# Altium schematic sheet Display.SchDoc
size A4; SheetNumber: 3; SheetTotal: 5
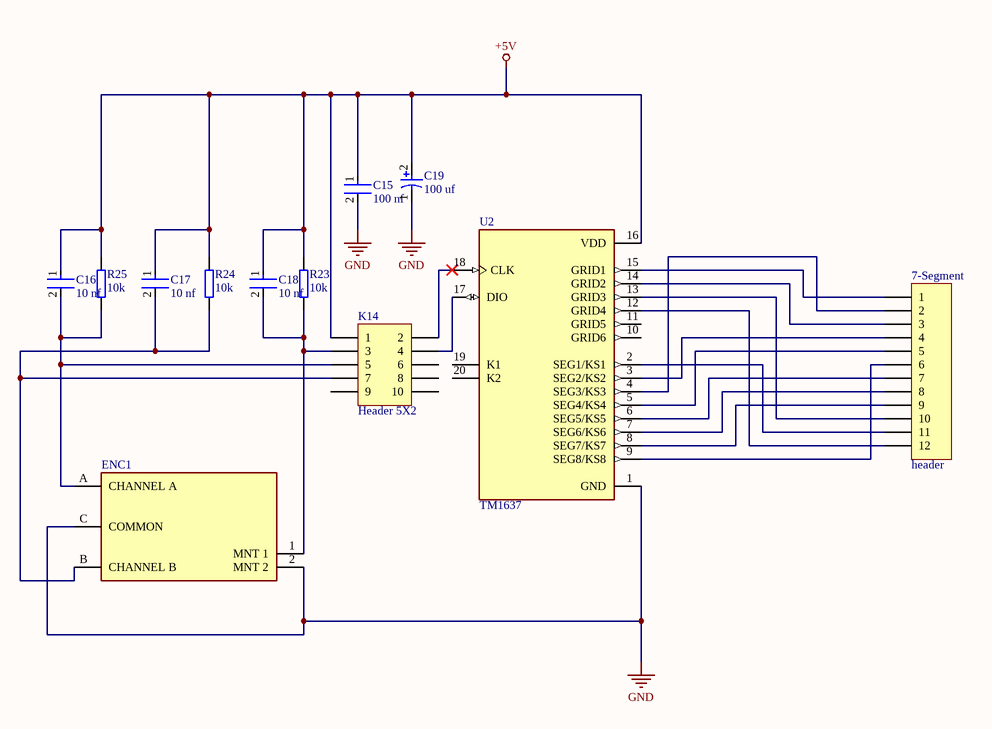
[diagram p0: Display.SchDoc]

## Parts
7-Segment  header  [HDR1X12]
C15  100 nf  [CC_0805_L]
C16  10 nf  [CC_0805_L]
C17  10 nf  [CC_0805_L]
C18  10 nf  [CC_0805_L]
C19  100 uf  [CE_D8_L10]
ENC1  (no value)  [PEC11R_4220F_S0012]
K14  Header 5X2  [HDR2X5]
R23  10k  [CC_0805_m]
R24  10k  [CC_0805_m]
R25  10k  [CC_0805_m]
U2  TM1637  [SOP_20_M]

## Nets
+5V: C15.1 C16.1 C17.1 C18.1 C19.2 K14.1 R23.2 R24.2 R25.2 U2.16(VDD)
GND: C15.2 C19.1 ENC1.2(MNT_2) ENC1.C(COMMON) U2.1(GND)
Net7-Segment_1: 7-Segment.1 U2.15(GRID1)
Net7-Segment_2: 7-Segment.2 U2.4(SEG3/KS3)
Net7-Segment_3: 7-Segment.3 U2.14(GRID2)
Net7-Segment_4: 7-Segment.4 U2.3(SEG2/KS2)
Net7-Segment_5: 7-Segment.5 U2.5(SEG4/KS4)
Net7-Segment_6: 7-Segment.6 U2.9(SEG8/KS8)
Net7-Segment_7: 7-Segment.7 U2.6(SEG5/KS5)
Net7-Segment_8: 7-Segment.8 U2.7(SEG6/KS6)
Net7-Segment_9: 7-Segment.9 U2.8(SEG7/KS7)
Net7-Segment_10: 7-Segment.10 U2.13(GRID3)
Net7-Segment_11: 7-Segment.11 U2.2(SEG1/KS1)
Net7-Segment_12: 7-Segment.12 U2.12(GRID4)
NetC16_2: C16.2 ENC1.A(CHANNEL_A) K14.5 R25.1
NetC17_2: C17.2 ENC1.B(CHANNEL_B) K14.7 R24.1
NetC18_2: C18.2 ENC1.1(MNT_1) K14.3 R23.1
NetK14_2: K14.2 U2.18(CLK)
NetK14_4: K14.4 U2.17(DIO)

Not connected (* = marked no-connect by the designer): K14 6 8 9 10; U2 10(GRID6) 11(GRID5) 19(K1) 20(K2)

## Library data of the parts
7-Segment = Header 12: Header, 12-Pin; LatestRevisionDate: 17-Jul-2002; LatestRevisionNote: Re-released for DXP Platform.; Publisher: Altium Limited
C15-C18 = Capacitor_Ceramic: Manufacturer: KEMET; Manufacturer Part Number: C0805C224K5RACTU; Value: 0.22 μF; Temperature Characteristic: X7R; Temperature Coefficient: 30ppm/°C; Tolerance: 0.1; Voltage Rating: 50 V; ComponentLink2URL: https://content.kemet.com/datasheets/KEM_C1003_C0G_SMD.pdf; Device Class L3: Ceramic Capacitors; Lead Free: Yes; Temperature: -55°C to +125°C; RoHS: TRUE; Capacitance: 0.22 μF; Automotive: No; Material: Ceramic; Octopart: https://octopart.com/c0805c224k5ractu-kemet-144670; Temperature Range Low: -55°C; Height: 0.88mm; Device Class L1: Passive Components; Digikey Description: CAP CER 0.22UF 50V X7R 0805; ComponentLink2Description: Datasheet; Mouser Description: CAP CER 0.22UF 50V X7R 0805; Category: Cap; Ipc Land Pattern Name: CAPC200125X78; Temperature Range High: +125°C; Package: C0805C-DN; Device Class L2: Capacitors
C19 = Capacitor_Electrolytic: Manufacturer: Panasonic; Voltage Rating: 25 V; ComponentLink2URL: http://industrial.panasonic.com/cdbs/www-data/pdf/RDE0000/ABA0000C1181.pdf; Height: 10.2 mm; Max Operating Temperature: 105 degC; PackageReference: EEE-FK1E221P; ComponentLink1Description: Manufacturer URL; ComponentLink1URL: http://www.panasonic.com/; Mount: Surface Mount; REACH SVHC: No SVHC; Min Operating Temperature: -55 degC; ComponentLink2Description: Datasheet; DatasheetVersion: 03/2016; Length: 10.2 mm; RoHSCompliant: true; Packaging: Tape and Reel; Package Quantity: 500; Lead Pitch: 3.1 mm; Pins: 2; PackageDescription: 2-Pin Electrolytic Aluminum Capacitor, Body 8.3 x 8.3 mm; Mounting Technology: Surface Mount
ENC1 = ROTARY_ENCODER: Manufacturer Part Number: PEC11R-4015F-N0024; Manufacturer: Bourns; Current Rating: 10mA; Number Of Circuits: 1; Conn Orientation: Vertical; Encoder Type: Incremental; Detent: No; Pulses Per Rev: 24; Voltage Rating Dc: 5V; Height: 22.3mm; ComponentLink2URL: https://www.bourns.com/docs/product-datasheets/pec11r.pdf?sfvrsn=bb617cbf_7; Mouser Description: Encoders 15mm SHAFT NO SWITCH; Package: 0; RoHS: TRUE; Temperature Range High: +70°C; Device Class L1: Electromechanical; Device Class L3: Encoders; Temperature Range Low: -30°C; Device Class L2: Switches; Temperature: -30°C to +70°C; Category: Enc; ComponentLink2Description: Datasheet; Lead Free: Yes; Automotive: No; Octopart: https://octopart.com/pec11r-4015f-n0024-bourns-26648251; Digikey Description: ROTARY ENCODER MECHANICAL 24PPR
K14 = Header 5X2: Header, 5-Pin, Dual row; LatestRevisionDate: 17-Jul-2002; LatestRevisionNote: Re-released for DXP Platform.; Publisher: Altium Limited
R23-R25 = Resistor: Manufacturer: Vishay Dale; Part Number: CRCW08050000Z0EA
U2 = TM1637: LED Drive Control Special Circuit; MF: Titan Micro Electronics; Package: Package; Availability: Not in stock; SnapEDA_Link: https://www.snapeda.com/parts/TM1637/Titan+Micro+Electronics/view-part/?ref=snap; MP: TM1637; Check_prices: https://www.snapeda.com/parts/TM1637/Titan+Micro+Electronics/view-part/?ref=eda; Value: *; Price: None